# EAGLE schematic screenModule (EAGLE 7.5.0)
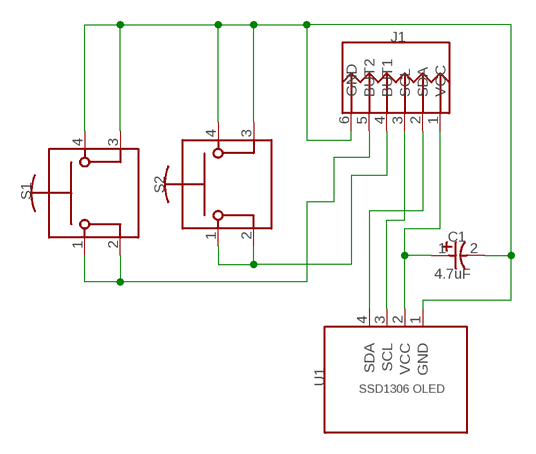
[diagram p0: schematic, sheet 1]

## Parts
C1  4.7uF  CAP100RP  [CAPPR-2.54/5.08]
J1  HDR-1X6  [HDR-1X6]
S1  B3W-4050  [B3F-5]
S2  B3W-4050  [B3F-5]
U1  OLED_SSD1306_128X64  [OLED_SSD1306]

## Nets
Net_0: C1.2(MINUS) J1.6(GND) S1.3(B) S1.4(B) S2.3(B) S2.4(B) U1.1(GND)
Net_1: C1.1(PLUS) J1.1(VCC) U1.2(VCC)
Net_2: J1.2(SDA) U1.4(SDA)
Net_3: J1.3(SCL) U1.3(SCL)
Net_5: J1.5(BUT2) S1.1(A) S1.2(A)
Net_6: J1.4(BUT1) S2.1(A) S2.2(A)

## Notes on the sheet
- J1
- S2
- S1
- C1
- 4.7uF
- U1
- SSD1306 OLED

## Library data of the parts
C1 = common:CAP100RP
J1 = common:HDR-1X6
S1 S2 = common:B3W-4050; DATASHEET: http://datasheets.diptrace.com/switches/B3W_1110.pdf; MANUFACTURER: OMRON
U1 = common:OLED_SSD1306_128X64; DATASHEET: shop.adafruit.com/datasheets/SSD1306.pdf